# Altium schematic sheet PWM_OUTPUT.SchDoc
size A; SheetNumber: 4; SheetTotal: 9
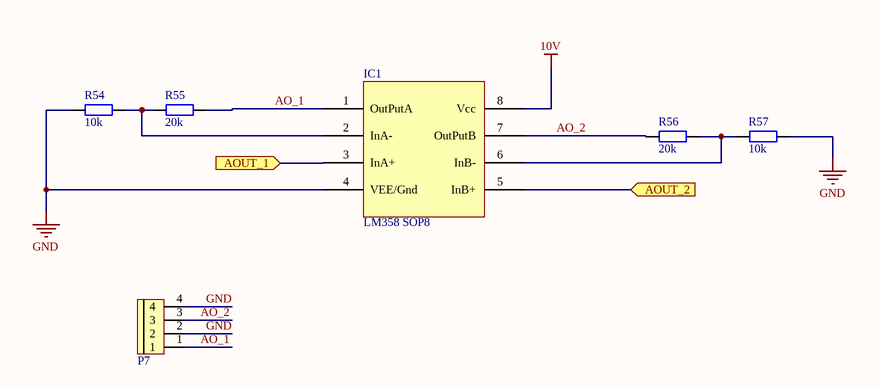
[diagram p0: PWM_OUTPUT.SchDoc]

## Parts
IC1  LM358 SOP8  [SOP 8]
P7  CON 4 EDG5.08  [CON 4 4EDG5.08]  (value not drawn)
R54  10k  [tro smd 0805]
R55  20k  [tro smd 0805]
R56  20k  [tro smd 0805]
R57  10k  [tro smd 0805]

## Ports
AOUT_1 (in), AOUT_2 (in)

## Nets
10V: IC1.8(Vcc)
GND: IC1.4(VEE/Gnd) P7.2 P7.4 R54.1 R57.2
AO_1: IC1.1(OutPutA) P7.1 R55.2
AO_2: IC1.7(OutPutB) P7.3 R56.1
AOUT_1: IC1.3(InA+) ; port AOUT_1
AOUT_2: IC1.5(InB+) ; port AOUT_2
NetIC1_2: IC1.2(InA-) R54.2 R55.1
NetIC1_6: IC1.6(InB-) R56.2 R57.1

## Library data of the parts
IC1 = LM358 SOP8: Dán; Ma_Hang: MH000609; Don_Vi: Con; Ten_Linh_Kien: LM358 SOP8; Kieu_Chan: *; Ghi_Chu: *; Chung_Loai: Dán
P7 = CON 4 EDG5.08: Cắm; Ten_Linh_Kien: CON 4 2EDG5.08-4P 5.08MM ( Xanh Cong); Ma_Hang: MH000979; Don_Vi: Con; Ghi_Chu: *; Kieu_Chan: *; Chung_Loai: Cắm
R54 R57 = Tro 0805 5% 10k: Dán; Don_Vi: Con; So_Chan: 2; Ten_Linh_Kien: Trở 0805 5% 10k; Ma_Hang: MH005239; Chung_Loai: Dán; Kieu_Chan: *
R55 R56 = Tro 0805 5% 20k: Dán; Don_Vi: Con; So_Chan: 2; Ten_Linh_Kien: Trở 0805 5% 20k; Ma_Hang: MH005247; Chung_Loai: Dán; Kieu_Chan: *